# Altium schematic sheet MCU_1.SchDoc
size A4; PageSetup: Record=PageOptions|CenterHorizontal=True|CenterVertical=True|PrintScale=0.98|XCorrection=1.00|YCorrection=1.00|PrintKind=0|BorderSize=5000000|LeftOffset=0|BottomOffset=0|Orientation=2|PaperLength=1000|PaperWidth=1000|Scale=100|PaperSource=7|PrintQuality=-4|MediaType=1|DitherType=10|PaperKind=A4 210x297 ºÁÃ×|PrintScaleMode=1
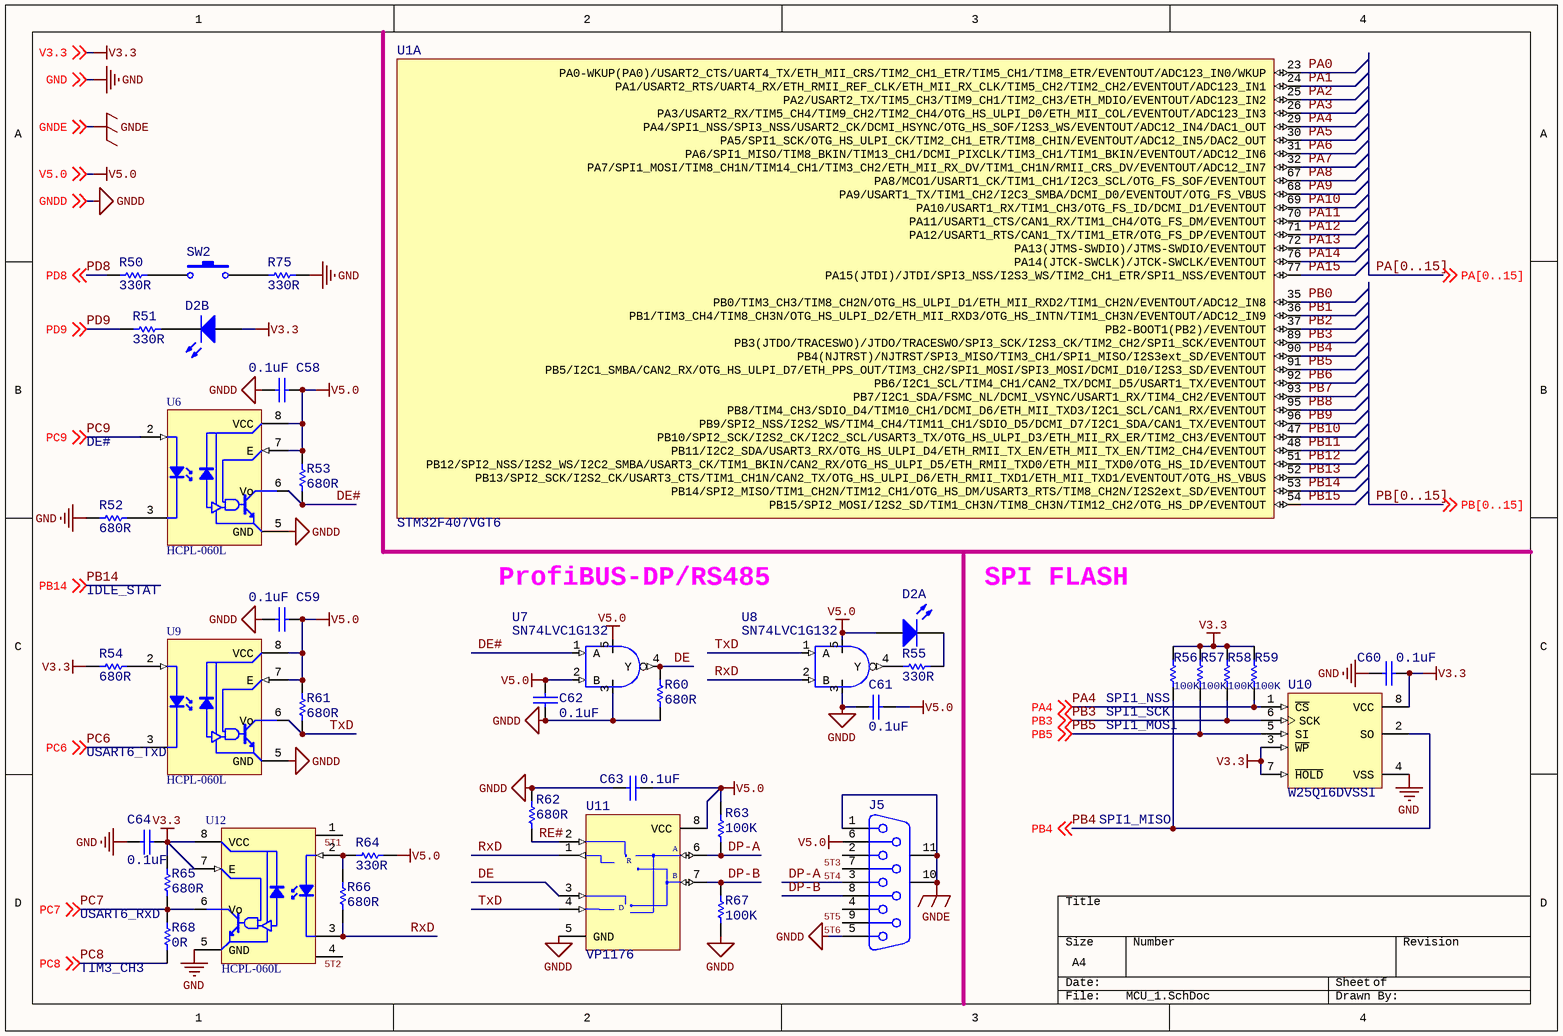
[diagram p0: MCU_1.SchDoc]

## Parts
C58  0.1uF  [C1608(0603)]
C59  0.1uF  [C1608(0603)]
C60  0.1uF  [C1608(0603)]
C61  0.1uF  [C1608(0603)]
C62  0.1uF  [C1608(0603)]
C63  0.1uF  [C1608(0603)]
C64  0.1uF  [C1608(0603)]
D2  LED-2  [LED-2]  (value not drawn)  (parts A,B of 2)
J5  D Connector 9  [DB9F]  (value not drawn)
R50  330R  [R1608(0603)]
R51  330R  [R1608(0603)]
R52  680R  [R1608(0603)]
R53  680R  [R1608(0603)]
R54  680R  [R1608(0603)]
R55  330R  [R1608(0603)]
R56  100K  [R1608(0603)]
R57  100K  [R1608(0603)]
R58  100K  [R1608(0603)]
R59  100K  [R1608(0603)]
R60  680R  [R1608(0603)]
R61  680R  [R1608(0603)]
R62  680R  [R1608(0603)]
R63  100K  [R1608(0603)]
R64  330R  [R1608(0603)]
R65  680R  [R1608(0603)]
R66  680R  [R1608(0603)]
R67  100K  [R1608(0603)]
R68  0R  [R1608(0603)]
R75  330R  [R1608(0603)]
SW2  SW-PB  [KEY 4.5x4.5x4.3mm]  (value not drawn)
U1  STM32F407VGT6  [TQFP100_N]  (part A of 5)
U6  HCPL-060L  [SO8_M]
U7  SN74LVC1G132  [SOT23-5_N]
U8  SN74LVC1G132  [SOT23-5_N]
U9  HCPL-060L  [SO8_M]
U10  W25Q16DVSSI  [SOIC8_M]
U11  VP1176  [SO8_M]
U12  HCPL-060L  [SO8_M]

## Nets
GND: C60.2 C64.2 R52.1 R75.2 U10.4(VSS) U12.5(GND) ; off-sheet GND
GNDD: C58.2 C59.2 C61.1 C62.2 C63.2 J5.5 R60.1 R62.2 R67.1 U6.5(GND) U7.3(GND) U8.3(GND) U9.5(GND) U11.5(GND) ; off-sheet GNDD
GNDE: J5.1 J5.10(MH1) J5.11(MH2) ; off-sheet GNDE
V3.3: C60.1 C64.1 D2.3(A2) R54.1 R56.2 R57.2 R58.2 R59.2 R65.2 U10.3(~{WP}) U10.7(~{HOLD}) U10.8(VCC) U12.7(E) U12.8(VCC) ; off-sheet V3.3
V5.0: C58.1 C59.1 C61.2 C62.1 C63.1 D2.1(A1) J5.6 R53.2 R61.2 R63.2 R64.2 U6.7(E) U6.8(VCC) U7.2(B) U7.5(VCC) U8.5(VCC) U9.7(E) U9.8(VCC) U11.8(VCC) ; off-sheet V5.0
5T1: U12.1
5T2: U12.4
5T3: J5.2
5T4: J5.7
5T5: J5.4
5T6: J5.9
DE: R60.2 U7.4(Y) U11.3(DE)
DE#: R53.1 U6.6(Vo) U7.1(A)
DP-A: J5.3 R63.1 U11.6(A)
DP-B: J5.8 R67.2 U11.7(B)
PA0: U1.23(PA0-WKUP(PA0)/USART2_CTS/UART4_TX/ETH_MII_CRS/TIM2_CH1_ETR/TIM5_CH1/TIM8_ETR/EVENTOUT/ADC123_IN0/WKUP)
PA1: U1.24(PA1/USART2_RTS/UART4_RX/ETH_RMII_REF_CLK/ETH_MII_RX_CLK/TIM5_CH2/TIM2_CH2/EVENTOUT/ADC123_IN1)
PA2: U1.25(PA2/USART2_TX/TIM5_CH3/TIM9_CH1/TIM2_CH3/ETH_MDIO/EVENTOUT/ADC123_IN2)
PA3: U1.26(PA3/USART2_RX/TIM5_CH4/TIM9_CH2/TIM2_CH4/OTG_HS_ULPI_D0/ETH_MII_COL/EVENTOUT/ADC123_IN3)
PA4: R59.1 U1.29(PA4/SPI1_NSS/SPI3_NSS/USART2_CK/DCMI_HSYNC/OTG_HS_SOF/I2S3_WS/EVENTOUT/ADC12_IN4/DAC1_OUT) U10.1(~{CS}) ; off-sheet PA4
PA5: U1.30(PA5/SPI1_SCK/OTG_HS_ULPI_CK/TIM2_CH1_ETR/TIM8_CHIN/EVENTOUT/ADC12_IN5/DAC2_OUT)
PA6: U1.31(PA6/SPI1_MISO/TIM8_BKIN/TIM13_CH1/DCMI_PIXCLK/TIM3_CH1/TIM1_BKIN/EVENTOUT/ADC12_IN6)
PA7: U1.32(PA7/SPI1_MOSI/TIM8_CH1N/TIM14_CH1/TIM3_CH2/ETH_MII_RX_DV/TIM1_CH1N/RMII_CRS_DV/EVENTOUT/ADC12_IN7)
PA8: U1.67(PA8/MCO1/USART1_CK/TIM1_CH1/I2C3_SCL/OTG_FS_SOF/EVENTOUT)
PA9: U1.68(PA9/USART1_TX/TIM1_CH2/I2C3_SMBA/DCMI_D0/EVENTOUT/OTG_FS_VBUS)
PA10: U1.69(PA10/USART1_RX/TIM1_CH3/OTG_FS_ID/DCMI_D1/EVENTOUT)
PA11: U1.70(PA11/USART1_CTS/CAN1_RX/TIM1_CH4/OTG_FS_DM/EVENTOUT)
PA12: U1.71(PA12/USART1_RTS/CAN1_TX/TIM1_ETR/OTG_FS_DP/EVENTOUT)
PA13: U1.72(PA13(JTMS-SWDIO)/JTMS-SWDIO/EVENTOUT)
PA14: U1.76(PA14(JTCK-SWCLK)/JTCK-SWCLK/EVENTOUT)
PA15: U1.77(PA15(JTDI)/JTDI/SPI3_NSS/I2S3_WS/TIM2_CH1_ETR/SPI1_NSS/EVENTOUT)
PB0: U1.35(PB0/TIM3_CH3/TIM8_CH2N/OTG_HS_ULPI_D1/ETH_MII_RXD2/TIM1_CH2N/EVENTOUT/ADC12_IN8)
PB1: U1.36(PB1/TIM3_CH4/TIM8_CH3N/OTG_HS_ULPI_D2/ETH_MII_RXD3/OTG_HS_INTN/TIM1_CH3N/EVENTOUT/ADC12_IN9)
PB2: U1.37(PB2-BOOT1(PB2)/EVENTOUT)
PB3: R58.1 U1.89(PB3(JTDO/TRACESWO)/JTDO/TRACESWO/SPI3_SCK/I2S3_CK/TIM2_CH2/SPI1_SCK/EVENTOUT) U10.6(SCK) ; off-sheet PB3
PB4: R56.1 U1.90(PB4(NJTRST)/NJTRST/SPI3_MISO/TIM3_CH1/SPI1_MISO/I2S3ext_SD/EVENTOUT) U10.2(SO) ; off-sheet PB4
PB5: R57.1 U1.91(PB5/I2C1_SMBA/CAN2_RX/OTG_HS_ULPI_D7/ETH_PPS_OUT/TIM3_CH2/SPI1_MOSI/SPI3_MOSI/DCMI_D10/I2S3_SD/EVENTOUT) U10.5(SI) ; off-sheet PB5
PB6: U1.92(PB6/I2C1_SCL/TIM4_CH1/CAN2_TX/DCMI_D5/USART1_TX/EVENTOUT)
PB7: U1.93(PB7/I2C1_SDA/FSMC_NL/DCMI_VSYNC/USART1_RX/TIM4_CH2/EVENTOUT)
PB8: U1.95(PB8/TIM4_CH3/SDIO_D4/TIM10_CH1/DCMI_D6/ETH_MII_TXD3/I2C1_SCL/CAN1_RX/EVENTOUT)
PB9: U1.96(PB9/SPI2_NSS/I2S2_WS/TIM4_CH4/TIM11_CH1/SDIO_D5/DCMI_D7/I2C1_SDA/CAN1_TX/EVENTOUT)
PB10: U1.47(PB10/SPI2_SCK/I2S2_CK/I2C2_SCL/USART3_TX/OTG_HS_ULPI_D3/ETH_MII_RX_ER/TIM2_CH3/EVENTOUT)
PB11: U1.48(PB11/I2C2_SDA/USART3_RX/OTG_HS_ULPI_D4/ETH_RMII_TX_EN/ETH_MII_TX_EN/TIM2_CH4/EVENTOUT)
PB12: U1.51(PB12/SPI2_NSS/I2S2_WS/I2C2_SMBA/USART3_CK/TIM1_BKIN/CAN2_RX/OTG_HS_ULPI_D5/ETH_RMII_TXD0/ETH_MII_TXD0/OTG_HS_ID/EVENTOUT)
PB13: U1.52(PB13/SPI2_SCK/I2S2_CK/USART3_CTS/TIM1_CH1N/CAN2_TX/OTG_HS_ULPI_D6/ETH_RMII_TXD1/ETH_MII_TXD1/EVENTOUT/OTG_HS_VBUS)
PB14: U1.53(PB14/SPI2_MISO/TIM1_CH2N/TIM12_CH1/OTG_HS_DM/USART3_RTS/TIM8_CH2N/I2S2ext_SD/EVENTOUT) ; off-sheet PB14
PB15: U1.54(PB15/SPI2_MOSI/I2S2_SD/TIM1_CH3N/TIM8_CH3N/TIM12_CH2/OTG_HS_DP/EVENTOUT)
PC6: U9.3(-) ; off-sheet PC6
PC7: R65.1 R68.2 U12.6(Vo) ; off-sheet PC7
PC8: R68.1 ; off-sheet PC8
PC9: U6.2(+) ; off-sheet PC9
PD8: R50.1 ; off-sheet PD8
PD9: R51.1 ; off-sheet PD9
RE#: R62.1 U11.2(~{RE})
RxD: R66.1 U8.2(B) U11.1(RO) U12.3(-)
TxD: R61.1 U8.1(A) U9.6(Vo) U11.4(DI)
NetD2_2: D2.2(K1) R55.2
NetD2_4: D2.4(K2) R51.2
NetR50_2: R50.2 SW2.1
NetR52_2: R52.2 U6.3(-)
NetR54_2: R54.2 U9.2(+)
NetR55_1: R55.1 U8.4(Y)
NetR64_1: R64.1 R66.2 U12.2(+)
NetR75_1: R75.1 SW2.2

Not connected (* = marked no-connect by the designer): U6 1 4; U9 1 4

## Buses and harness runs
bus PA[0..15]
bus PB[0..15]

## Notes on the sheet
- DE#
- IDLE_STAT
- ProfiBUS-DP/RS485
- SPI FLASH
- (near R56) SPI1_NSS
- (near R56) SPI1_SCK
- (near U9) USART6_TxD
- SPI1_MOSI
- SPI1_MISO
- USART6_RxD
- (near R68) TIM3_CH3
- (in symbol MAX485ESA) R; D

## Library data of the parts
C58-C64 = CAP: Capacitor
D2 = LED-2: Typical INFRARED GaAs LED; Published: 8-Jun-2000; LatestRevisionDate: 08-Jul-2005; LatestRevisionNote: Mech Layer 1 removed.; PackageReference: LED-0; Publisher: Altium Limited
J5 = D Connector 9: Receptacle Assembly, 9 Position, Right Angle; PackageDocument: O; Positions: 9; Published: 15-Jun-2001; LatestRevisionDate: 17-Jul-2002; LatestRevisionNote: Re-released for DXP Platform.; DatasheetDocument: 1-Sep-1999; PackageReference: 788750; Publisher: Altium Limited; Orientation: Right Angle; Gender: Receptacle
R50-R68 R75 = Res Semi: Semiconductor Resistor; Value: 1K; Published: 8-Jun-2000; LatestRevisionDate: 17-Jul-2002; LatestRevisionNote: Re-released for DXP Platform.; PackageReference: AXIAL-0.5; Publisher: Altium Limited
SW2 = SW-PB: Switch; Published: 24-Mar-1999; LatestRevisionDate: 17-Jul-2002; LatestRevisionNote: Re-released for DXP Platform.; PackageReference: SPST-2; Publisher: Altium Limited
U1 = STM32F407VGT6: ARM Cortex-M4 32b MCU+FPU, 210DMIP, 1024 kB Flash, 192+4 kB RAM, Camera, 82 I/Os, 100-pin LQFP, -40 to +85°C, Tray; Internal RAM: 192kB; Operating Frequency (Processor Speed): 168MHz; A/D Converter: 16x12-bit; D/A Converter: 2x12-bit; 16-bit Timers (IC/OC/PWM): 12x16-bit(24/24/30); 32-bit Timer (IC/OC/PWM): 2x32-bit (8/8/8); Other Timer Functions: 2xWDG, RTC, 24-bit down counter; Serial Interface: 3xSPI/2xI2S/2xI2C/3xUSART(IrDa, ISO7816)/3xUART/2xUSB OTG FS/HS, 2xCAN/Ethernet MAC10/100, SDIO; DatasheetVersion: rev2, Jan-2012; PackageVersion: 2012; PackageReference: LQFP100; PackageDescription: 100-Pin Low Profile Quad Flat Package, 14x14 mm Body, 0.5 mm Pitch; ComponentLink1Description: Manufacturer URL; ComponentLink1URL: http://www.st.com/; ComponentLink2Description: STM32F405/7 Datasheet; ComponentLink2URL: http://www.st.com/internet/com/TECHNICAL_RESOURCES/TECHNICAL_LITERATURE/DATASHEET/DM00037051.pdf; ComponentLink3Description: STM32F4 Web Page; ComponentLink3URL: http://www.st.com/internet/mcu/subclass/1521.jsp
U6 U9 U12 = HCPL-060
U10 = 25AA640A-I/SN: 64K SPI Bus Serial EEPROM, 8-Pin SOIC, Industrial Temperature; FirstPublished: 29-Jan-2009; LatestRevisionDate: 02-Dec-2009; LatestRevisionNote: Updated to datasheet revision D, Jan-2008; DatasheetVersion: revD, Oct-2008; PackageVersion: revBB, Aug-2009; PackageReference: SOIC-SN8; Publisher: Altium Limited; PackageDescription: 8-Lead Plastic Small Outline (SN) - Narrow, 3.90mm Body [SOIC]; Supplier 1: Digi-Key; Supplier Part Number 1: 25AA640A-I/SN-ND; Supplier 2: Newark; Supplier Part Number 2: 27M1299; Code_JEDEC: MS-012; Code_IPC: SOIC127P600-8; ComponentLink1Description: Datasheet; ComponentLink1URL: http://ww1.microchip.com/downloads/en/DeviceDoc/21830D.pdf
U11 = MAX485ESA: Low-Power, Slew-Rate-Limited RS-485/RS-422 Transceiver; Published: 16-Jan-2001; LatestRevisionDate: 13-Apr-2006; LatestRevisionNote: IPC-7351 Footprint Added.; DatasheetVersion: Feb-1996; PackageReference: NSO8; Publisher: Altium Limited; PackageDescription: 8-Pin Small Outline Integrated Circuit 1.27 mm Pitch; Code_JEDEC: MS-012-AA; Code_IPC: SOIC127P600-8; ComponentLink1Description: Manufacturer Link; ComponentLink1URL: http://www.maxim-ic.com/; ComponentLink2Description: Datasheet; ComponentLink2URL: http://pdfserv.maxim-ic.com/en/ds/MAX1487-MAX491.pdf